# Altium project MC-IMX6Q-BOARD.PRJPCB
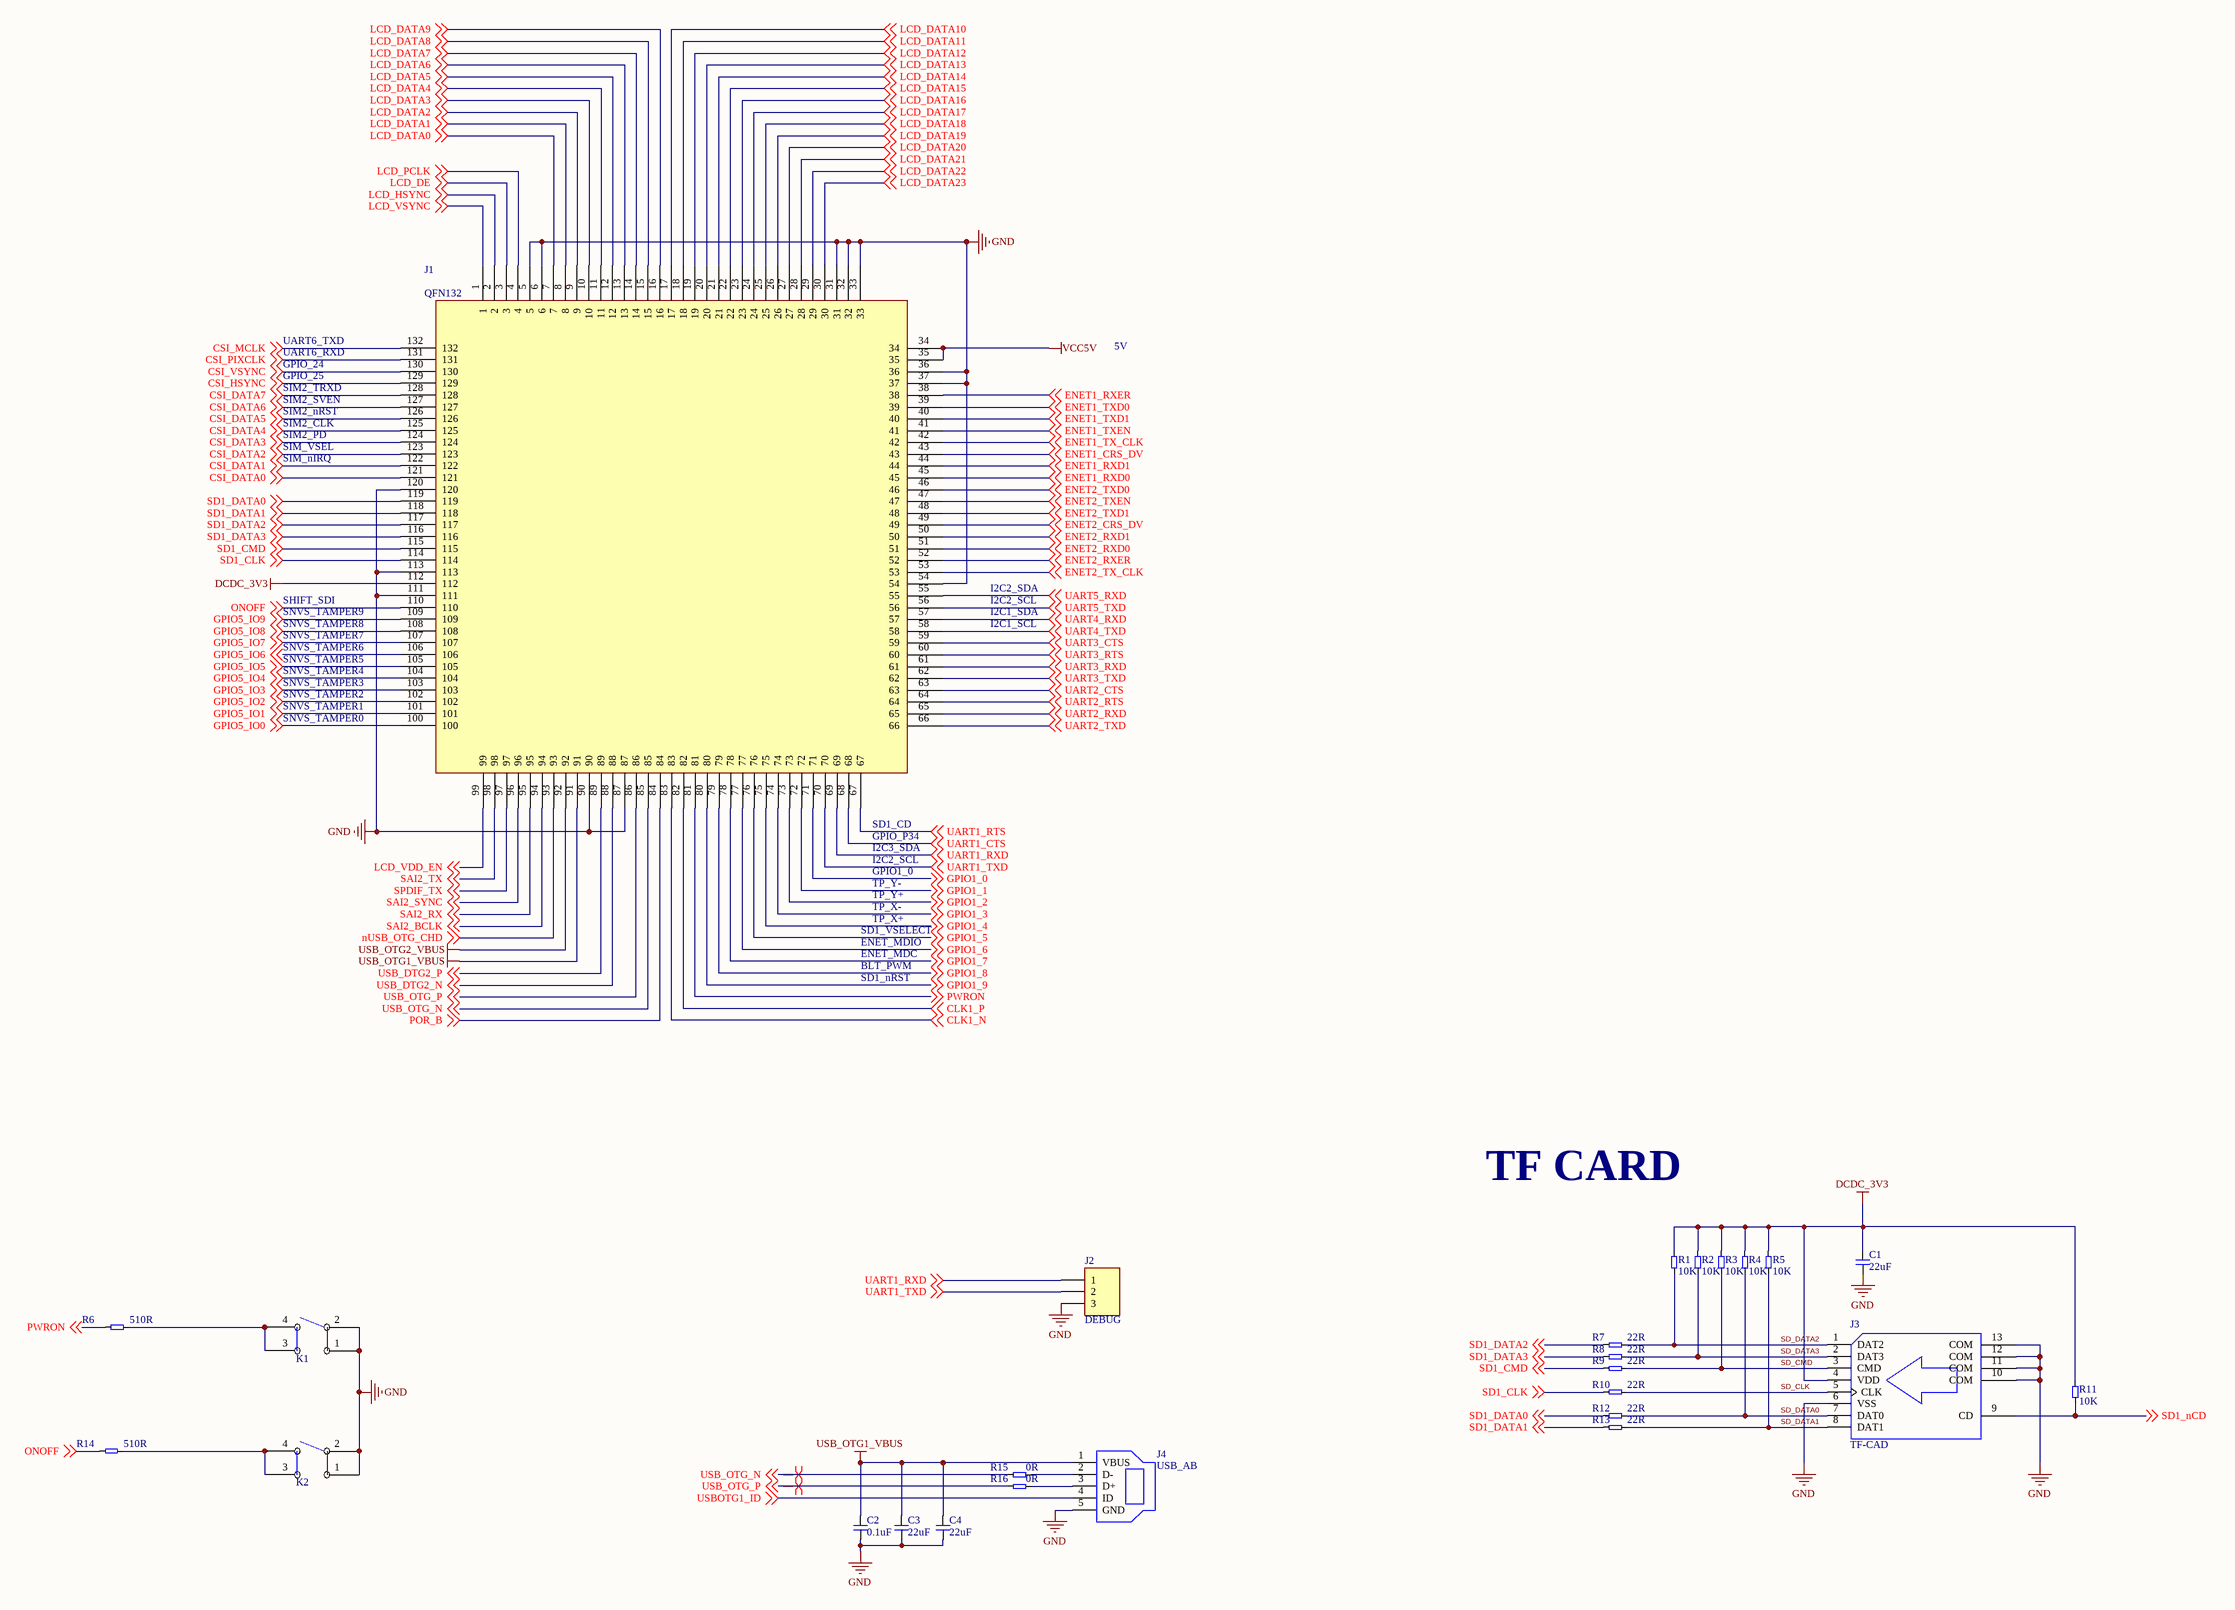
[diagram p0: 0.CONNECTOR.SchDoc]
4 sheets, 146 parts. Net scope: global (net labels, ports and power ports of the same name join across sheets).
Board file: IMX6.PcbDoc
Sheets:
  0.CONNECTOR.SchDoc
  1.POWER.SchDoc
  2.ETH.SchDoc
  9.RGB&TOUCH.SchDoc

## Sheet 0.CONNECTOR.SchDoc
size A2

### Parts
C1  22uF  [0805C]
C2  0.1uF  [0603C]
C3  22uF  [0805C]
C4  22uF  [0805C]
J1  QFN132  [QFN132]
J2  DEBUG  [HDR1X3]
J3  TF-CAD  [TF-CARD]
J4  USB_AB  [MINI USB B]
K1  按键  [SS-SPB-4.5]  (value not drawn)
K2  按键  [SS-SPB-4.5]  (value not drawn)
R1  10K  [0603R]
R2  10K  [0603R]
R3  10K  [0603R]
R4  10K  [0603R]
R5  10K  [0603R]
R6  510R  [0603R]
R7  22R  [0603R]
R8  22R  [0603R]
R9  22R  [0603R]
R10  22R  [0603R]
R11  10K  [0603R]
R12  22R  [0603R]
R13  22R  [0603R]
R14  510R  [0603R]
R15  0R  [0603R]
R16  0R  [0603R]

### Nets
DCDC_3V3: C1.2 J1.112 J3.4(VDD) R1.2 R2.2 R3.2 R4.2 R5.2 R11.2
EARTH: C1.1 C2.1 C3.1 C4.1 J1.5 J1.6 J1.31 J1.32 J1.33 J1.36 J1.37 J1.54 J1.87 J1.90 J1.111 J1.113 J1.120 J2.3 J3.6(VSS) J3.10(COM) J3.11(COM) J3.12(COM) J3.13(COM) J4.5(GND) J4.6(9) J4.7(9) J4.8(9) J4.9 K1.1 K1.2 K2.1 K2.2  [also labelled GND]  [project net AUGND]
USB_OTG1_VBUS: C2.2 C3.2 C4.2 J1.91 J4.1(VBUS)
USB_OTG2_VBUS: J1.92
VCC5V: J1.34 J1.35
CLK1_N: J1.83 ; off-sheet CLK1_N
CLK1_P: J1.82 ; off-sheet CLK1_P
CSI_DATA0: J1.121 ; off-sheet CSI_DATA0
CSI_DATA1: J1.122 ; off-sheet CSI_DATA1
CSI_DATA2: J1.123 ; off-sheet CSI_DATA2
CSI_DATA3: J1.124 ; off-sheet CSI_DATA3
CSI_DATA4: J1.125 ; off-sheet CSI_DATA4
CSI_DATA5: J1.126 ; off-sheet CSI_DATA5
CSI_DATA6: J1.127 ; off-sheet CSI_DATA6
CSI_DATA7: J1.128 ; off-sheet CSI_DATA7
CSI_HSYNC: J1.129 ; off-sheet CSI_HSYNC
CSI_MCLK: J1.132 ; off-sheet CSI_MCLK
CSI_PIXCLK: J1.131 ; off-sheet CSI_PIXCLK
CSI_VSYNC: J1.130 ; off-sheet CSI_VSYNC
ENET1_CRS_DV: J1.43 ; off-sheet ENET1_CRS_DV
ENET1_RXD0: J1.45 ; off-sheet ENET1_RXD0
ENET1_RXD1: J1.44 ; off-sheet ENET1_RXD1
ENET1_RXER: J1.38 ; off-sheet ENET1_RXER
ENET1_TX_CLK: J1.42 ; off-sheet ENET1_TX_CLK
ENET1_TXD0: J1.39 ; off-sheet ENET1_TXD0
ENET1_TXD1: J1.40 ; off-sheet ENET1_TXD1
ENET1_TXEN: J1.41 ; off-sheet ENET1_TXEN
ENET2_CRS_DV: J1.49 ; off-sheet ENET2_CRS_DV
ENET2_RXD0: J1.51 ; off-sheet ENET2_RXD0
ENET2_RXD1: J1.50 ; off-sheet ENET2_RXD1
ENET2_RXER: J1.52 ; off-sheet ENET2_RXER
ENET2_TX_CLK: J1.53 ; off-sheet ENET2_TX_CLK
ENET2_TXD0: J1.46 ; off-sheet ENET2_TXD0
ENET2_TXD1: J1.48 ; off-sheet ENET2_TXD1
ENET2_TXEN: J1.47 ; off-sheet ENET2_TXEN
GPIO1_0: J1.71 ; off-sheet GPIO1_0
GPIO1_1: J1.72 ; off-sheet GPIO1_1
GPIO1_2: J1.73 ; off-sheet GPIO1_2
GPIO1_3: J1.74 ; off-sheet GPIO1_3
GPIO1_4: J1.75 ; off-sheet GPIO1_4
GPIO1_5: J1.76 ; off-sheet GPIO1_5
GPIO1_6: J1.77 ; off-sheet GPIO1_6
GPIO1_7: J1.78 ; off-sheet GPIO1_7
GPIO1_8: J1.79 ; off-sheet GPIO1_8
GPIO1_9: J1.80 ; off-sheet GPIO1_9
GPIO5_IO0: J1.100 ; off-sheet GPIO5_IO0
GPIO5_IO1: J1.101 ; off-sheet GPIO5_IO1
GPIO5_IO2: J1.102 ; off-sheet GPIO5_IO2
GPIO5_IO3: J1.103 ; off-sheet GPIO5_IO3
GPIO5_IO4: J1.104 ; off-sheet GPIO5_IO4
GPIO5_IO5: J1.105 ; off-sheet GPIO5_IO5
GPIO5_IO6: J1.106 ; off-sheet GPIO5_IO6
GPIO5_IO7: J1.107 ; off-sheet GPIO5_IO7
GPIO5_IO8: J1.108 ; off-sheet GPIO5_IO8
GPIO5_IO9: J1.109 ; off-sheet GPIO5_IO9
LCD_DATA0: J1.7 ; off-sheet LCD_DATA0
LCD_DATA1: J1.8 ; off-sheet LCD_DATA1
LCD_DATA2: J1.9 ; off-sheet LCD_DATA2
LCD_DATA3: J1.10 ; off-sheet LCD_DATA3
LCD_DATA4: J1.11 ; off-sheet LCD_DATA4
LCD_DATA5: J1.12 ; off-sheet LCD_DATA5
LCD_DATA6: J1.13 ; off-sheet LCD_DATA6
LCD_DATA7: J1.14 ; off-sheet LCD_DATA7
LCD_DATA8: J1.15 ; off-sheet LCD_DATA8
LCD_DATA9: J1.16 ; off-sheet LCD_DATA9
LCD_DATA10: J1.17 ; off-sheet LCD_DATA10
LCD_DATA11: J1.18 ; off-sheet LCD_DATA11
LCD_DATA12: J1.19 ; off-sheet LCD_DATA12
LCD_DATA13: J1.20 ; off-sheet LCD_DATA13
LCD_DATA14: J1.21 ; off-sheet LCD_DATA14
LCD_DATA15: J1.22 ; off-sheet LCD_DATA15
LCD_DATA16: J1.23 ; off-sheet LCD_DATA16
LCD_DATA17: J1.24 ; off-sheet LCD_DATA17
LCD_DATA18: J1.25 ; off-sheet LCD_DATA18
LCD_DATA19: J1.26 ; off-sheet LCD_DATA19
LCD_DATA20: J1.27 ; off-sheet LCD_DATA20
LCD_DATA21: J1.28 ; off-sheet LCD_DATA21
LCD_DATA22: J1.29 ; off-sheet LCD_DATA22
LCD_DATA23: J1.30 ; off-sheet LCD_DATA23
LCD_DE: J1.3 ; off-sheet LCD_DE
LCD_HSYNC: J1.2 ; off-sheet LCD_HSYNC
LCD_PCLK: J1.4 ; off-sheet LCD_PCLK
LCD_VDD_EN: J1.99 ; off-sheet LCD_VDD_EN
LCD_VSYNC: J1.1 ; off-sheet LCD_VSYNC
nUSB_OTG_CHD: J1.93 ; off-sheet nUSB_OTG_CHD
ONOFF: J1.110 R14.2 ; off-sheet ONOFF
POR_B: J1.84 ; off-sheet POR_B
PWRON: J1.81 R6.2 ; off-sheet PWRON
SAI2_BCLK: J1.94 ; off-sheet SAI2_BCLK
SAI2_RX: J1.95 ; off-sheet SAI2_RX
SAI2_SYNC: J1.96 ; off-sheet SAI2_SYNC
SAI2_TX: J1.98 ; off-sheet SAI2_TX
SD1_CLK: J1.114 R10.1 ; off-sheet SD1_CLK
SD1_CMD: J1.115 R9.1 ; off-sheet SD1_CMD
SD1_DATA0: J1.119 R12.1 ; off-sheet SD1_DATA0
SD1_DATA1: J1.118 R13.1 ; off-sheet SD1_DATA1
SD1_DATA2: J1.117 R7.1 ; off-sheet SD1_DATA2
SD1_DATA3: J1.116 R8.1 ; off-sheet SD1_DATA3
SD1_nCD: J3.9(CD) R11.1 ; off-sheet SD1_nCD
SD_CLK: J3.5(CLK) R10.2
SD_CMD: J3.3(CMD) R3.1 R9.2
SD_DATA0: J3.7(DAT0) R4.1 R12.2
SD_DATA1: J3.8(DAT1) R5.1 R13.2
SD_DATA2: J3.1(DAT2) R1.1 R7.2
SD_DATA3: J3.2(DAT3) R2.1 R8.2
SPDIF_TX: J1.97 ; off-sheet SPDIF_TX
UART1_CTS: J1.68 ; off-sheet UART1_CTS
UART1_RTS: J1.67 ; off-sheet UART1_RTS
UART1_RXD: J1.69 J2.1 ; off-sheet UART1_RXD
UART1_TXD: J1.70 J2.2 ; off-sheet UART1_TXD
UART2_CTS: J1.63 ; off-sheet UART2_CTS
UART2_RTS: J1.64 ; off-sheet UART2_RTS
UART2_RXD: J1.65 ; off-sheet UART2_RXD
UART2_TXD: J1.66 ; off-sheet UART2_TXD
UART3_CTS: J1.59 ; off-sheet UART3_CTS
UART3_RTS: J1.60 ; off-sheet UART3_RTS
UART3_RXD: J1.61 ; off-sheet UART3_RXD
UART3_TXD: J1.62 ; off-sheet UART3_TXD
UART4_RXD: J1.57 ; off-sheet UART4_RXD
UART4_TXD: J1.58 ; off-sheet UART4_TXD
UART5_RXD: J1.55 ; off-sheet UART5_RXD
UART5_TXD: J1.56 ; off-sheet UART5_TXD
USB_DTG2_N: J1.88 ; off-sheet USB_DTG2_N
USB_DTG2_P: J1.89 ; off-sheet USB_DTG2_P
USB_OTG_N: J1.85 R15.2 ; off-sheet USB_OTG_N
USB_OTG_P: J1.86 R16.2 ; off-sheet USB_OTG_P
USBOTG1_ID: J4.4(ID) ; off-sheet USBOTG1_ID
NetJ4_2: J4.2(D-) R15.1
NetJ4_3: J4.3(D+) R16.1
NetK1_3: K1.3 K1.4 R6.1
NetK2_3: K2.3 K2.4 R14.1

### Layout directives
differential pair: USB_OTG_N, USB_OTG_P

### Notes on the sheet
- UART6_TXD
- UART6_RXD
- GPIO_24
- GPIO_25
- SIM2_TRXD
- 5V
- SIM2_PD
- SIM2_CLK
- SIM2_nRST
- SIM2_SVEN
- SIM_nIRQ
- SIM_VSEL
- SNVS_TAMPER8
- SNVS_TAMPER9
- SHIFT_SDI
- I2C1_SCL
- I2C1_SDA
- I2C2_SCL
- I2C2_SDA
- SNVS_TAMPER4
- SNVS_TAMPER5
- SNVS_TAMPER7
- SNVS_TAMPER6
- SNVS_TAMPER0
- SNVS_TAMPER1
- SNVS_TAMPER2
- SNVS_TAMPER3
- I2C3_SDA
- SD1_CD
- GPIO_P34
- GPIO1_0
- TP_Y-
- TP_Y+
- TP_X-
- SD1_VSELECT
- ENET_MDIO
- ENET_MDC
- BLT_PWM
- SD1_nRST
- TP_X+
- TF CARD

### Library data of the parts
C1-C4 = 电容
J2 = Header 3: Header, 3-Pin; LatestRevisionDate: 17-Jul-2002; LatestRevisionNote: Re-released for DXP Platform.; Publisher: Altium Limited
J4 = USB_AB: 小USB插痤
R1-R16 = 电阻

## Sheet 1.POWER.SchDoc
size A4
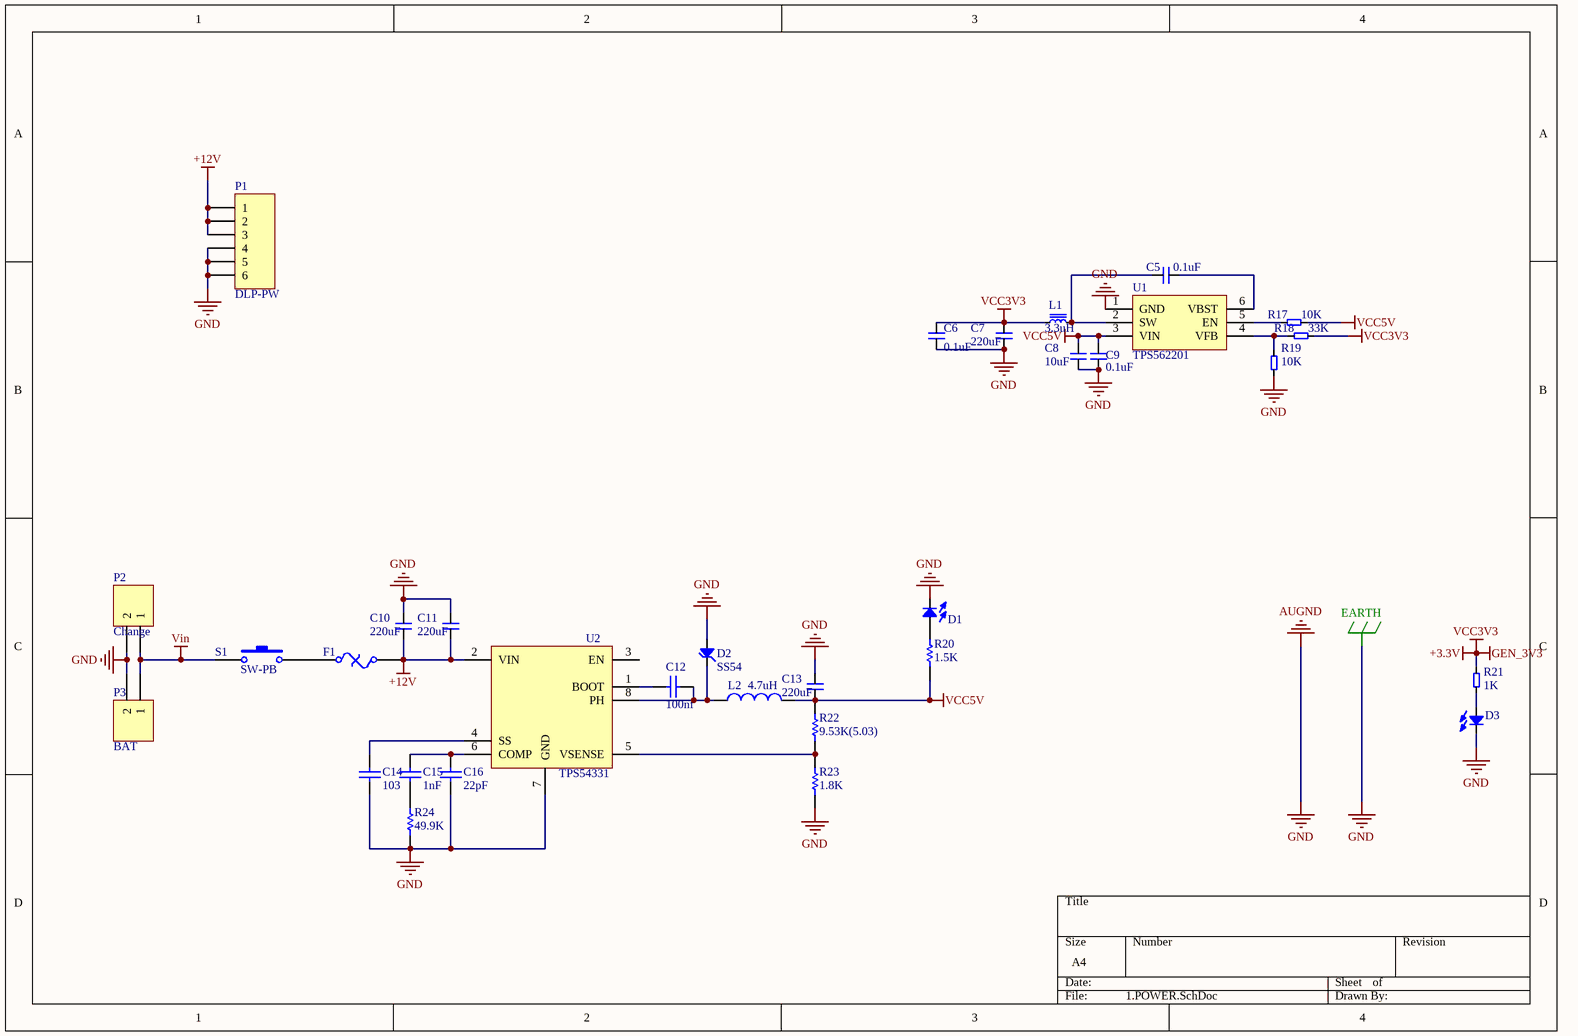
[diagram p1: 1.POWER.SchDoc]

### Parts
C5  0.1uF  [0603C]
C6  0.1uF  [0603C]
C7  220uF  [1210C]
C8  10uF  [0603C]
C9  0.1uF  [0603C]
C10  220uF  [1210C]
C11  220uF  [1210C]
C12  value 100nf  [0603C]  (hidden comment: Cap)
C13  220uF  [1210C]
C14  value 103  [0603C]  (hidden comment: Cap)
C15  value 1nF  [0603C]  (hidden comment: Cap)
C16  value 22pF  [0603C]  (hidden comment: Cap)
D1  发光二极管  [0603D]  (value not drawn)
D2  SS54  [SMA]
D3  发光二极管  [0603D]  (value not drawn)
F1  Fuse Thermal  [1812F]  (value not drawn)
L1  3.3uH  [L4030]
L2  value 4.7uH  [L-6045]  (hidden comment: Inductor)
P1  DLP-PW  [SH1.0-6P]
P2  Change  [DC-005]
P3  BAT  [XH2.54-2P]
R17  10K  [0603R]
R18  33K  [0603R]
R19  10K  [0603R]
R20  value 1.5K  [0603R]  (hidden comment: Res1)
R21  1K  [0603R]
R22  value 9.53K(5.03)  [0603R]  (hidden comment: Res Semi)
R23  value 1.8K  [0603R]  (hidden comment: Res Semi)
R24  value 49.9K  [0603R]  (hidden comment: Res Semi)
S1  SW-PB  [SPST-2]
U1  TPS562201  [SOT23-6-DC]
U2  TPS54331  [SOP8-POW]

### Nets
+3.3V: C6.1 C7.1 L1.1 R18.1 R21.2  [also labelled GEN_3V3, VCC3V3]
+12V: C10.2 C11.2 F1.2 P1.1 P1.2 P1.3 U2.2(VIN)
AUGND: C6.2 C7.2 C8.2 C9.2 C10.1 C11.1 C13.1 C14.2 C16.1 D1.K D2.A D3.K P1.4 P1.5 P1.6 P2.2 P3.2 R19.1 R23.1 R24.1 U1.1(GND) U2.7(GND) U2.9(PAD)  [also labelled EARTH, GND]
VCC5V: C8.1 C9.1 C13.2 L2.2 R17.1 R20.1 R22.2 U1.3(VIN)
Vin: P2.1 P3.1 S1.1
NetC5_1: C5.1 L1.2 U1.2(SW)
NetC5_2: C5.2 U1.6(VBST)
NetC12_1: C12.1 D2.K L2.1 U2.8(PH)
NetC12_2: C12.2 U2.1(BOOT)
NetC14_1: C14.1 U2.4(SS)
NetC15_1: C15.1 R24.2
NetC15_2: C15.2 C16.2 U2.6(COMP)
NetD1_A: D1.A R20.2
NetD3_A: D3.A R21.1
NetF1_1: F1.1 S1.2
NetR17_2: R17.2 U1.5(EN)
NetR18_2: R18.2 R19.2 U1.4(VFB)
NetR22_1: R22.1 R23.2 U2.5(VSENSE)

Not connected (* = marked no-connect by the designer): U2 3(EN)

### Library data of the parts
C5-C11 C13 = 电容
C12 C14-C16 = Cap: Capacitor; Published: 8-Jun-2000; LatestRevisionDate: 17-Jul-2002; LatestRevisionNote: Re-released for DXP Platform.; PackageReference: RAD-0.3; Publisher: Altium Limited
  C14-C16: PackageDescription: Radial Cap, Thru-Hole; 2 Leads; 0.3 in Pin Spacing
D2 = SS24: DIODES: *
F1 = Fuse Thermal: Thermal Fuse; Published: 24-Mar-1999; LatestRevisionDate: 17-Jul-2002; LatestRevisionNote: Re-released for DXP Platform.; PackageReference: PIN-W2/E2.8; Publisher: Altium Limited
L1 = 功率电感
L2 = Inductor: Code_IEC: 1005; Published: 8-Jun-2000; LatestRevisionDate: 17-Jul-2002; LatestRevisionNote: Re-released for DXP Platform.; PackageReference: 0402-A; Publisher: Altium Limited; Code_JEITA: 0402
P1 = Header 6: Header, 6-Pin; LatestRevisionDate: 17-Jul-2002; LatestRevisionNote: Re-released for DXP Platform.; Publisher: Altium Limited
P2 P3 = Header 2: Header, 2-Pin; LatestRevisionDate: 17-Jul-2002; LatestRevisionNote: Re-released for DXP Platform.; Publisher: Altium Limited
R17-R19 R21 = 电阻
R20 = Res1: Resistor; Published: 8-Jun-2000; LatestRevisionDate: 17-Jul-2002; LatestRevisionNote: Re-released for DXP Platform.; PackageReference: AXIAL-0.3; Publisher: Altium Limited
R22-R24 = Res Semi: Semiconductor Resistor; Published: 8-Jun-2000; LatestRevisionDate: 17-Jul-2002; LatestRevisionNote: Re-released for DXP Platform.; PackageReference: AXIAL-0.5; Publisher: Altium Limited; PackageDescription: Axial Device, Thru-Hole; 2 Leads; 0.5 in Pin Spacing
S1 = SW-PB: Switch; Published: 24-Mar-1999; LatestRevisionDate: 17-Jul-2002; LatestRevisionNote: Re-released for DXP Platform.; PackageReference: SPST-2; Publisher: Altium Limited

## Sheet 2.ETH.SchDoc
size A3
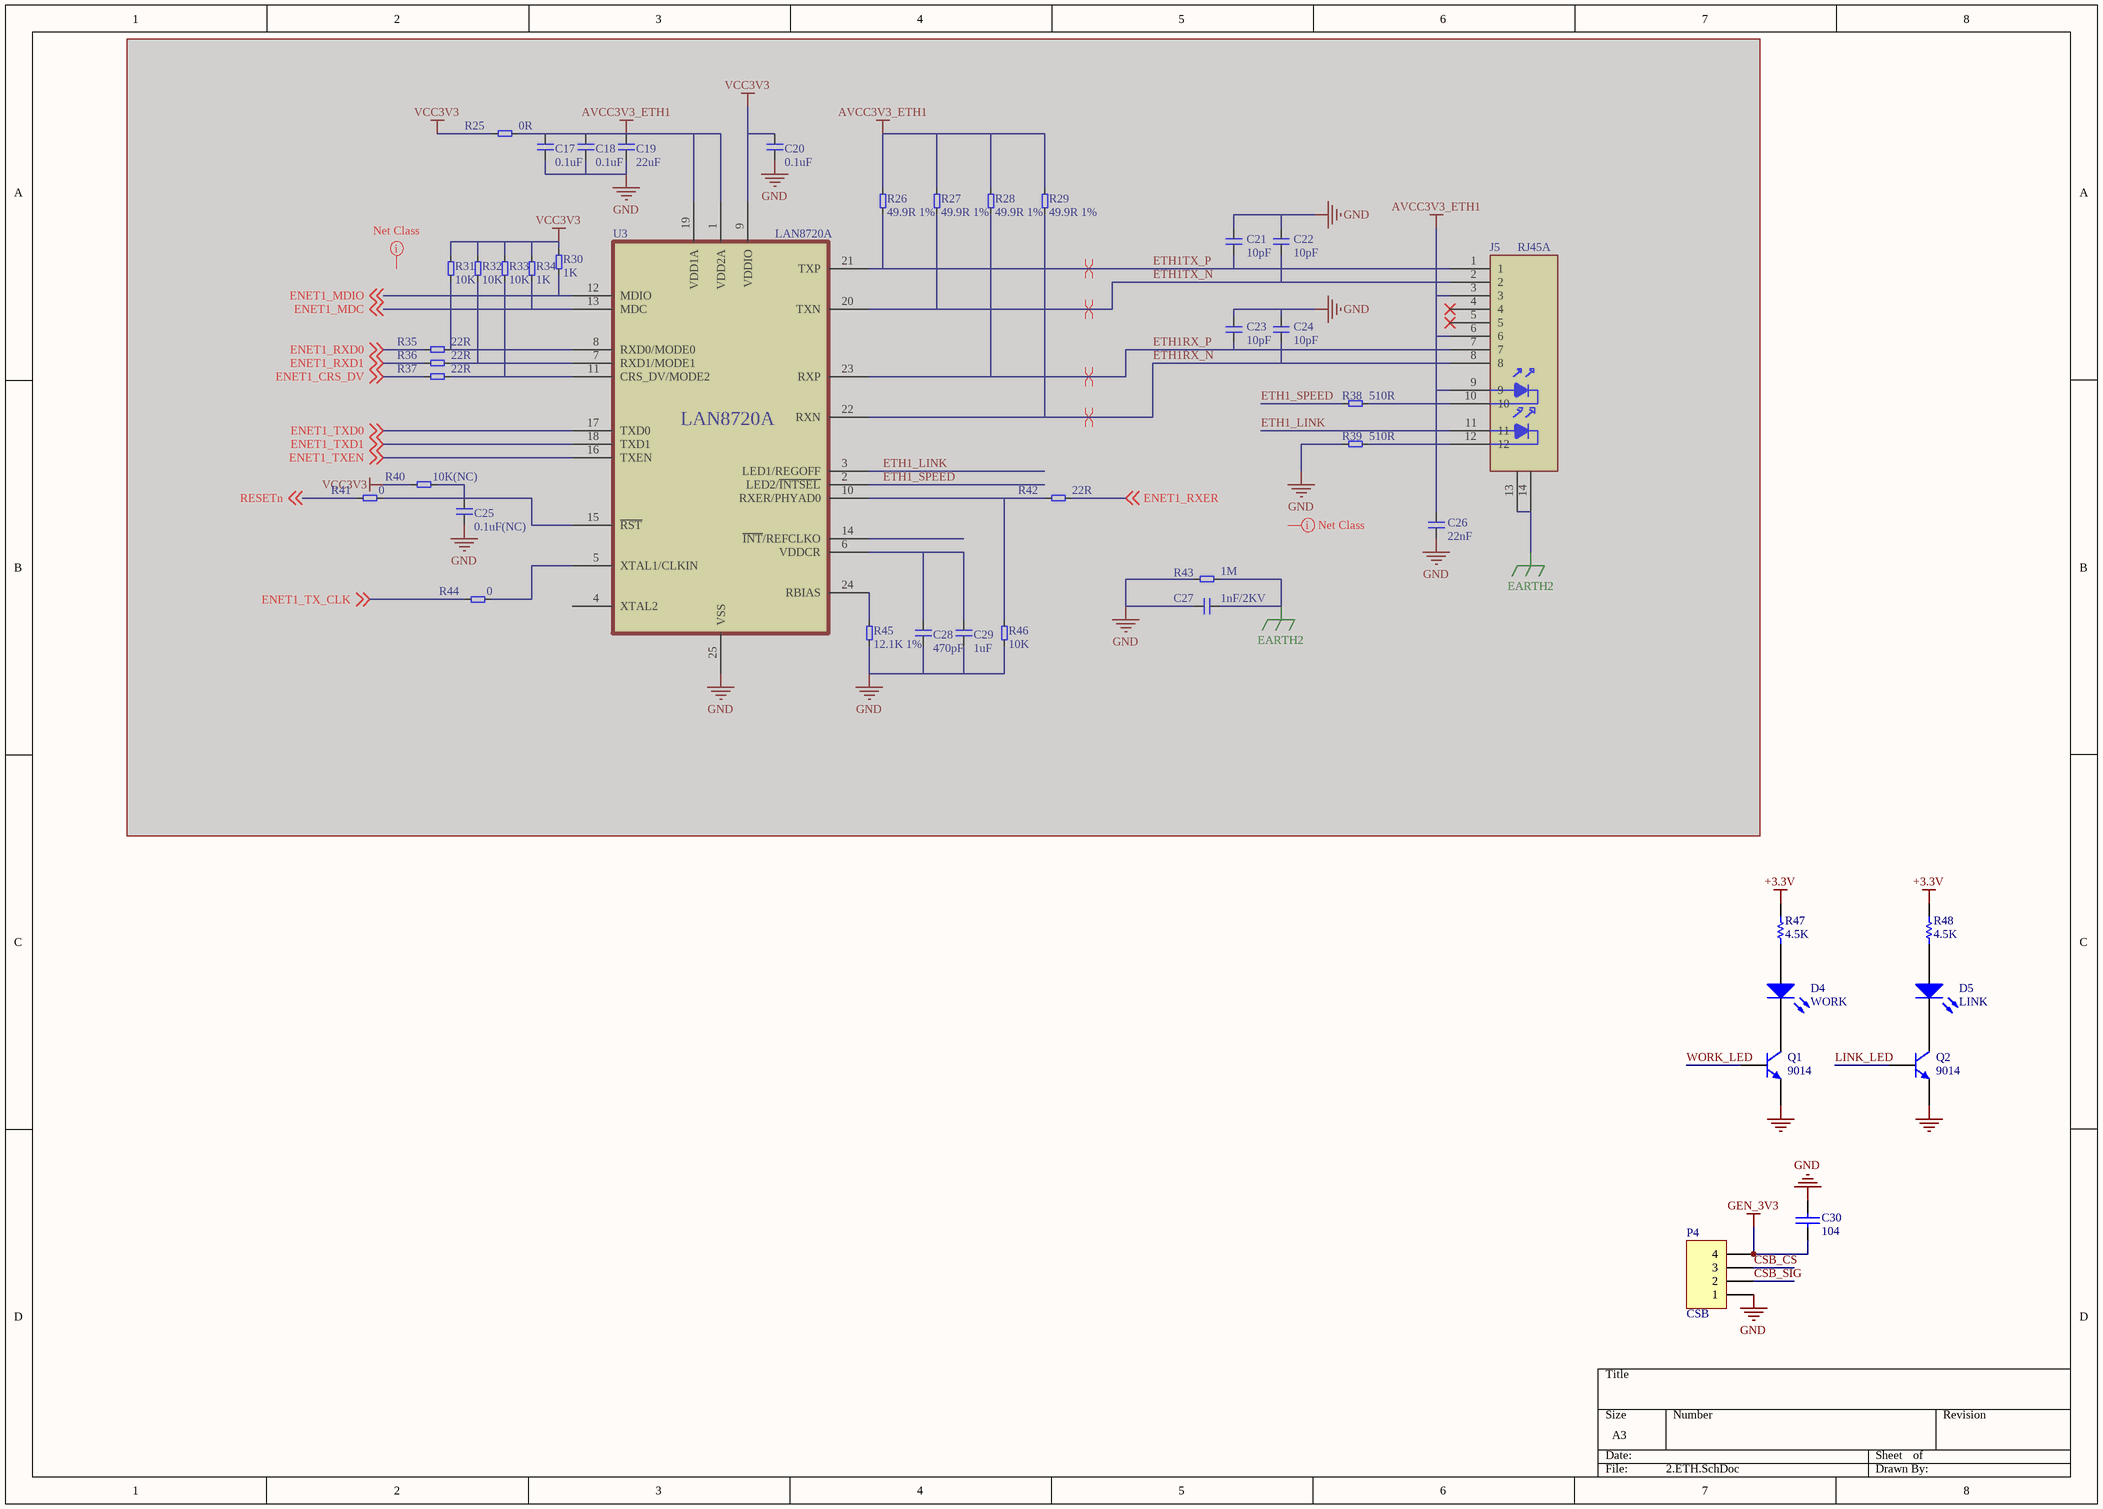
[diagram p2: 2.ETH.SchDoc]

### Parts
(Parts that share a designator on the sheet are numbered #1, #2 ... from top to bottom, then left to right.)
C17#1  0.1uF  [0603C]  (masked out: inside a compile mask, not in the netlist)
C18#1  0.1uF  [0603C]  (masked out: inside a compile mask, not in the netlist)
C19  22uF  [0805C]  (masked out: inside a compile mask, not in the netlist)
C20  0.1uF  [0603C]  (masked out: inside a compile mask, not in the netlist)
C21  10pF  [0603C]  (masked out: inside a compile mask, not in the netlist)
C22  10pF  [0603C]  (masked out: inside a compile mask, not in the netlist)
C23  10pF  [0603C]  (masked out: inside a compile mask, not in the netlist)
C24  10pF  [0603C]  (masked out: inside a compile mask, not in the netlist)
C25  0.1uF(NC)  [0603C]  (masked out: inside a compile mask, not in the netlist)
C26  22nF  [0603C]  (masked out: inside a compile mask, not in the netlist)
C27  1nF/2KV  [DC-200]  (masked out: inside a compile mask, not in the netlist)
C28  470pF  [0603C]  (masked out: inside a compile mask, not in the netlist)
C29  1uF  [0603C]  (masked out: inside a compile mask, not in the netlist)
C30  104  [0603]
D4  WORK  [0603-LED]
D5  LINK  [0603-LED]
J5#1  RJ45A  [RJ45B-13F-60LDNL]  (masked out: inside a compile mask, not in the netlist)
P4  CSB  [HDR1X4]
Q1  value 9014  [SOT-23-NPN]  (hidden comment: NPN)
Q2  value 9014  [SOT-23-NPN]  (hidden comment: NPN)
R25  0R  [0603R]  (masked out: inside a compile mask, not in the netlist)
R26  49.9R 1%  [0603R]  (masked out: inside a compile mask, not in the netlist)
R27  49.9R 1%  [0603R]  (masked out: inside a compile mask, not in the netlist)
R28  49.9R 1%  [0603R]  (masked out: inside a compile mask, not in the netlist)
R29  49.9R 1%  [0603R]  (masked out: inside a compile mask, not in the netlist)
R30  1K  [0603R]  (masked out: inside a compile mask, not in the netlist)
R31  10K  [0603R]  (masked out: inside a compile mask, not in the netlist)
R32  10K  [0603R]  (masked out: inside a compile mask, not in the netlist)
R33  10K  [0603R]  (masked out: inside a compile mask, not in the netlist)
R34  1K  [0603R]  (masked out: inside a compile mask, not in the netlist)
R35  22R  [0603R]  (masked out: inside a compile mask, not in the netlist)
R36  22R  [0603R]  (masked out: inside a compile mask, not in the netlist)
R37  22R  [0603R]  (masked out: inside a compile mask, not in the netlist)
R38  510R  [0603R]  (masked out: inside a compile mask, not in the netlist)
R39  510R  [0603R]  (masked out: inside a compile mask, not in the netlist)
R40  10K(NC)  [0603R]  (masked out: inside a compile mask, not in the netlist)
R41  0  [0603R]  (masked out: inside a compile mask, not in the netlist)
R42  22R  [0603R]  (masked out: inside a compile mask, not in the netlist)
R43  1M  [1206R]  (masked out: inside a compile mask, not in the netlist)
R44  0  [0603R]  (masked out: inside a compile mask, not in the netlist)
R45  12.1K 1%  [0603R]  (masked out: inside a compile mask, not in the netlist)
R46  10K  [0603R]  (masked out: inside a compile mask, not in the netlist)
R47  value 4.5K  [0603]  (hidden comment: Res1)
R48  value 4.5K  [0603]  (hidden comment: Res1)
U3  LAN8720A  [QFN24]  (masked out: inside a compile mask, not in the netlist)

### Nets
+3.3V: C30.2 P4.4 R47.1 R48.1  [also labelled GEN_3V3]
GND: C30.1 P4.1 Q1.1(E) Q2.1(E)  [project net AUGND]
CSB_CS: P4.3
CSB_SIG: P4.2
LINK_LED: Q2.2(B)
WORK_LED: Q1.2(B)
NetD4_1: D4.1(A) R47.2
NetD4_2: D4.2(K) Q1.3(C)
NetD5_1: D5.1(A) R48.2
NetD5_2: D5.2(K) Q2.3(C)

### Layout directives
differential pair: (no net found under the mark)
net class ETH0: (no net found under the mark)

### Library data of the parts
C17#1 C18#1 C19-C29 = 电容
C30 = CAP
D4 D5 = LED2: Typical RED, GREEN, YELLOW, AMBER GaAs LED; Value: GRN; Published: 8-Jun-2000; LatestRevisionDate: 17-Jul-2002; LatestRevisionNote: Re-released for DXP Platform.; PackageDocument: Feb-2002; PackageReference: 3.2X1.6X1.1; Publisher: Altium Limited
P4 = Header 4: Header, 4-Pin; LatestRevisionDate: 17-Jul-2002; LatestRevisionNote: Re-released for DXP Platform.; Publisher: Altium Limited
Q1 Q2 = 2N5551: NPN General Purpose Amplifier; Published: 8-Jun-2000; LatestRevisionDate: 17-Jan-2003; LatestRevisionNote: PCB Footprint 'BCY-W3/D4.7' replaced; DatasheetDocument: 1997; PackageDocument: Sep-1998; PackageReference: TO-92A; Publisher: Altium Limited; ComponentLink1Description: Manufacturer Link; ComponentLink1URL: http://www.fairchildsemi.com/; ComponentLink2Description: Datasheet; ComponentLink2URL: http://www.fairchildsemi.com/ds/2N%2F2N5551.pdf
R25-R46 = 电阻
R47 R48 = Res1: Resistor; Published: 8-Jun-2000; LatestRevisionDate: 17-Jul-2002; LatestRevisionNote: Re-released for DXP Platform.; PackageReference: AXIAL-0.3; Publisher: Altium Limited

## Sheet 9.RGB&TOUCH.SchDoc
size A3
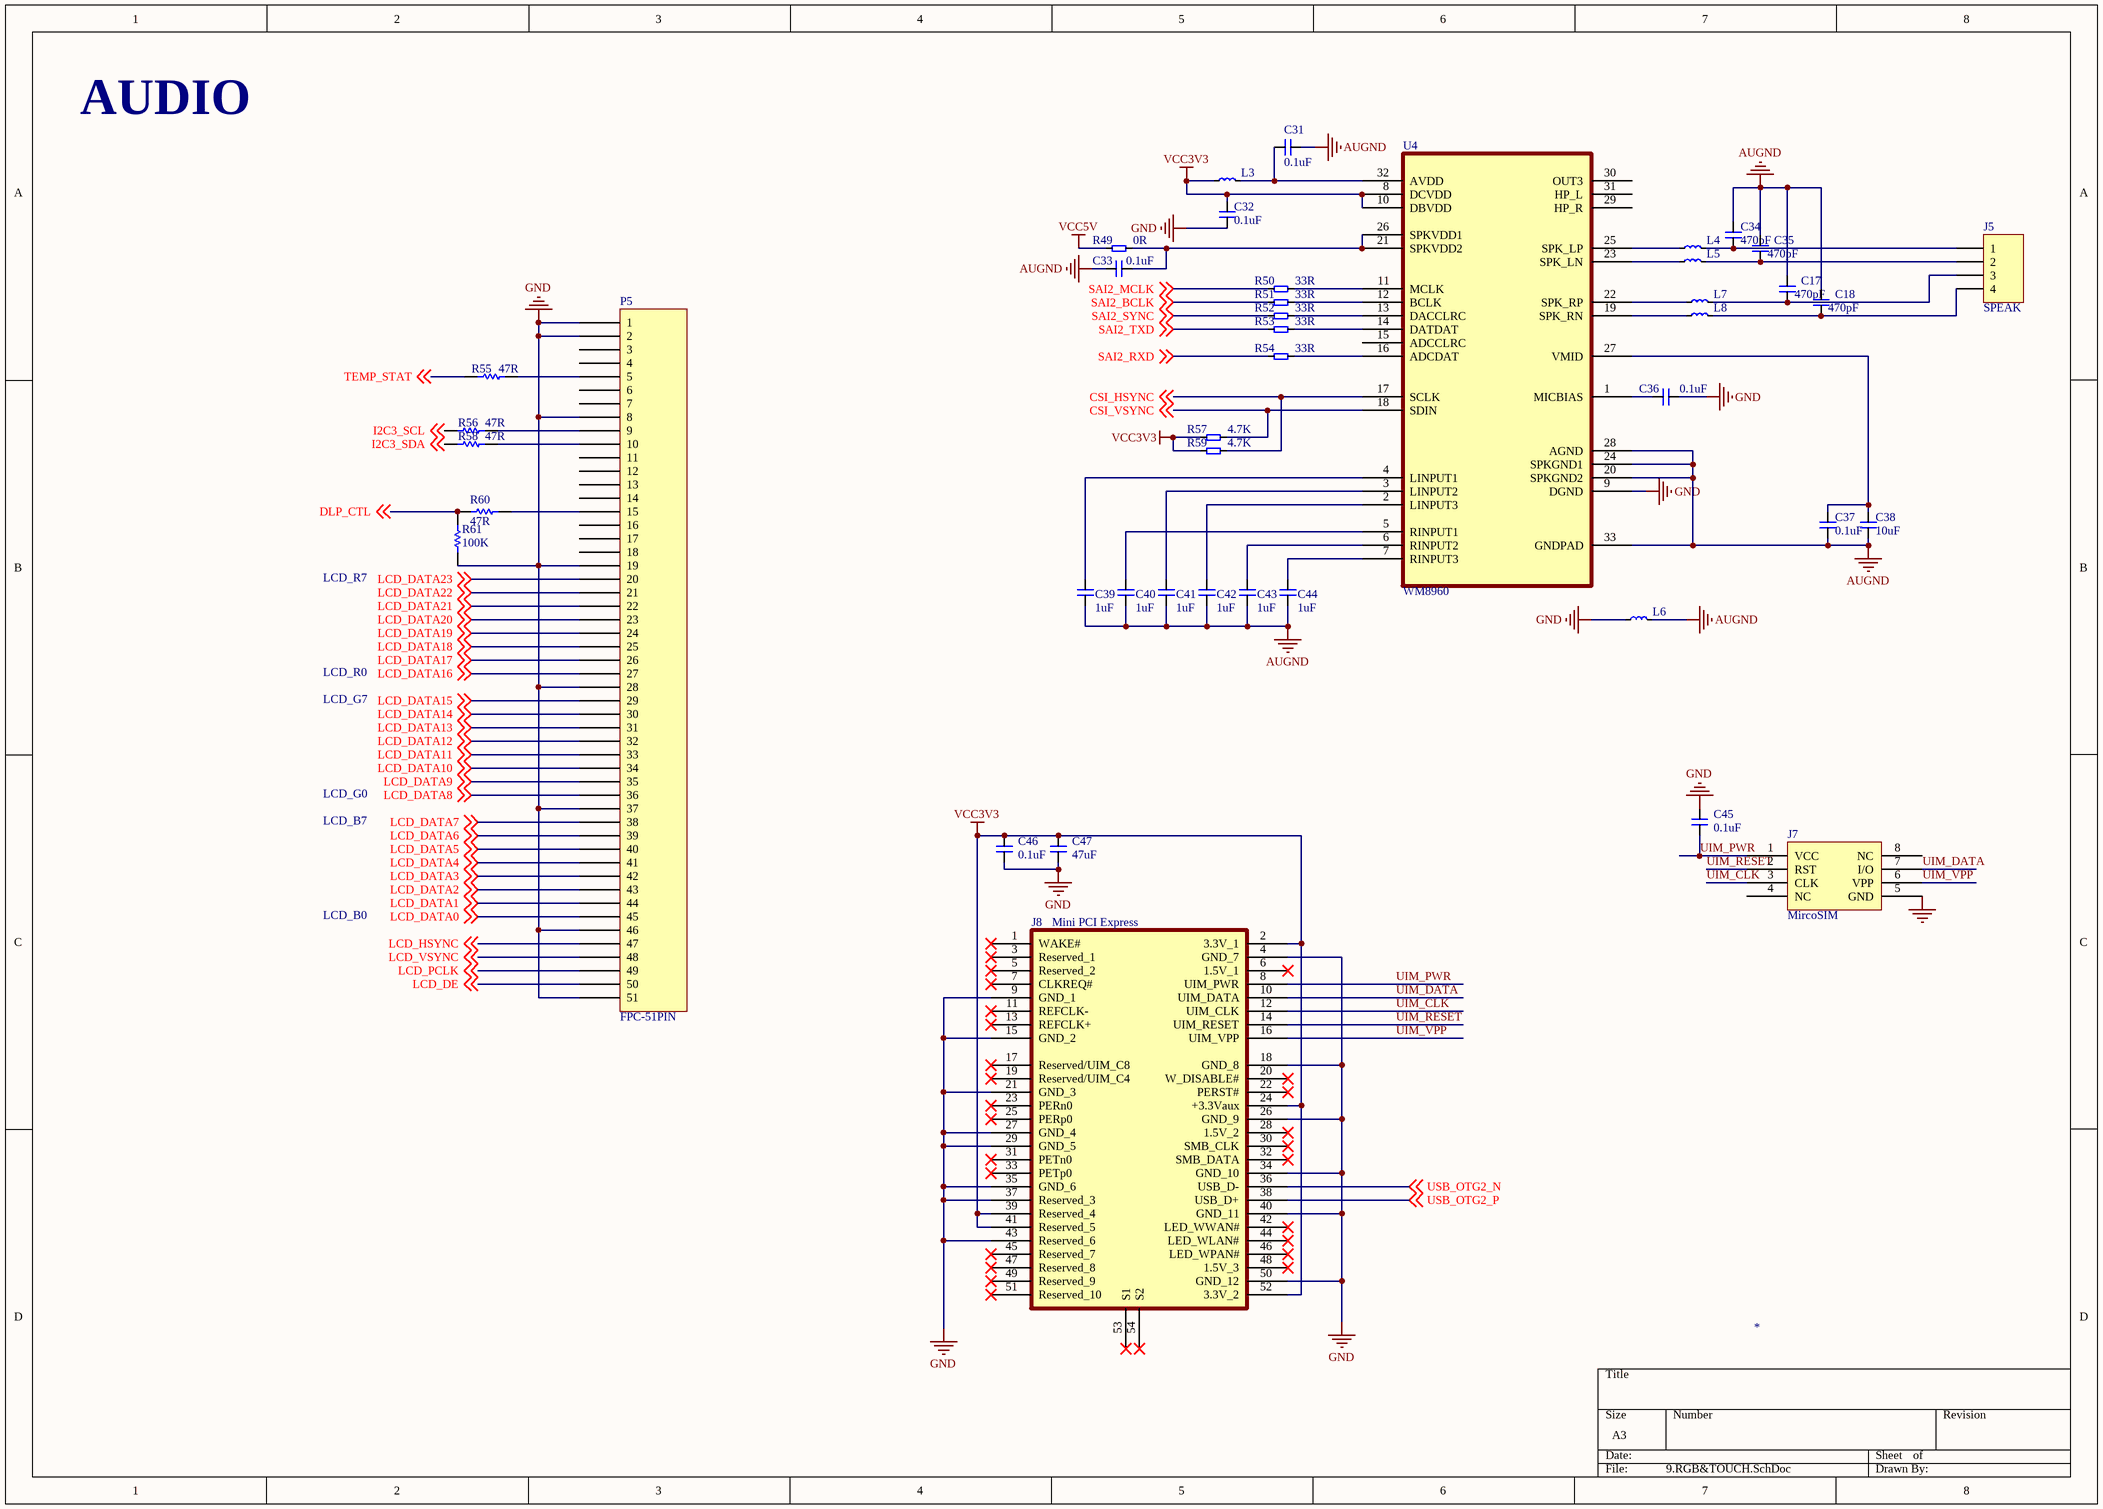
[diagram p3: 9.RGB&TOUCH.SchDoc]

### Parts
(Parts that share a designator on the sheet are numbered #1, #2 ... from top to bottom, then left to right.)
C17#2  470pF  [0603C]
C18#2  470pF  [0603C]
C31  0.1uF  [0603C]
C32  0.1uF  [0603C]
C33  0.1uF  [0603C]
C34  470pF  [0603C]
C35  470pF  [0603C]
C36  0.1uF  [0603C]
C37  0.1uF  [0603C]
C38  10uF  [0805C]
C39  1uF  [0603C]
C40  1uF  [0603C]
C41  1uF  [0603C]
C42  1uF  [0603C]
C43  1uF  [0603C]
C44  1uF  [0603C]
C45  0.1uF  [0603C]
C46  0.1uF  [0603C]
C47  47uF  [1206C]
J5#2  SPEAK  [1.25-4P]
J7  MircoSIM  [Micro SIM]
J8  Mini PCI Express  [MINI-PCIE-SHORT]
L3  电感  [0603L]  (value not drawn)
L4  电感  [0603L]  (value not drawn)
L5  电感  [0603L]  (value not drawn)
L6  电感  [0603L]  (value not drawn)
L7  电感  [0603L]  (value not drawn)
L8  电感  [0603L]  (value not drawn)
P5  FPC-51PIN  [FH26-51S-0.3SHW]
R49  0R  [0603R]
R50  33R  [0603R]
R51  33R  [0603R]
R52  33R  [0603R]
R53  33R  [0603R]
R54  33R  [0603R]
R55  47R  [0603]
R56  47R  [0603]
R57  4.7K  [0603R]
R58  47R  [0603]
R59  4.7K  [0603R]
R60  47R  [0603]
R61  100K  [0603]
U4  WM8960  [QFN-32]

### Nets
AUGND: C17#2.2 C18#2.2 C31.2 C32.2 C33.1 C34.2 C35.2 C36.2 C37.2 C38.2 C39.1 C40.1 C41.1 C42.1 C43.1 C44.1 C45.1 C46.2 C47.2 J7.5(GND) J8.4(GND_7) J8.9(GND_1) J8.15(GND_2) J8.18(GND_8) J8.21(GND_3) J8.26(GND_9) J8.27(GND_4) J8.29(GND_5) J8.34(GND_10) J8.35(GND_6) J8.37(Reserved_3) J8.40(GND_11) J8.43(Reserved_6) J8.50(GND_12) L6.1 L6.2 P5.1 P5.2 P5.8 P5.19 P5.28 P5.37 P5.46 P5.51 R61.1 U4.9(DGND) U4.20(SPKGND2) U4.24(SPKGND1) U4.28(AGND) U4.33(GNDPAD)  [also labelled GND]
VCC3V3: C32.1 C46.1 C47.1 J8.2(3.3V_1) J8.24(+3.3Vaux) J8.39(Reserved_4) J8.41(Reserved_5) J8.52(3.3V_2) L3.1 R57.1 R59.1 U4.8(DCVDD) U4.10(DBVDD)  [project net +3.3V]
VCC5V: R49.1
CSI_HSYNC: R59.2 U4.17(SCLK) ; off-sheet CSI_HSYNC
CSI_VSYNC: R57.2 U4.18(SDIN) ; off-sheet CSI_VSYNC
DLP_CTL: R60.1 R61.2 ; off-sheet DLP_CTL
I2C3_SCL: R56.1 ; off-sheet I2C3_SCL
I2C3_SDA: R58.1 ; off-sheet I2C3_SDA
LCD_DATA0: P5.45 ; off-sheet LCD_DATA0
LCD_DATA1: P5.44 ; off-sheet LCD_DATA1
LCD_DATA2: P5.43 ; off-sheet LCD_DATA2
LCD_DATA3: P5.42 ; off-sheet LCD_DATA3
LCD_DATA4: P5.41 ; off-sheet LCD_DATA4
LCD_DATA5: P5.40 ; off-sheet LCD_DATA5
LCD_DATA6: P5.39 ; off-sheet LCD_DATA6
LCD_DATA7: P5.38 ; off-sheet LCD_DATA7
LCD_DATA8: P5.36 ; off-sheet LCD_DATA8
LCD_DATA9: P5.35 ; off-sheet LCD_DATA9
LCD_DATA10: P5.34 ; off-sheet LCD_DATA10
LCD_DATA11: P5.33 ; off-sheet LCD_DATA11
LCD_DATA12: P5.32 ; off-sheet LCD_DATA12
LCD_DATA13: P5.31 ; off-sheet LCD_DATA13
LCD_DATA14: P5.30 ; off-sheet LCD_DATA14
LCD_DATA15: P5.29 ; off-sheet LCD_DATA15
LCD_DATA16: P5.27 ; off-sheet LCD_DATA16
LCD_DATA17: P5.26 ; off-sheet LCD_DATA17
LCD_DATA18: P5.25 ; off-sheet LCD_DATA18
LCD_DATA19: P5.24 ; off-sheet LCD_DATA19
LCD_DATA20: P5.23 ; off-sheet LCD_DATA20
LCD_DATA21: P5.22 ; off-sheet LCD_DATA21
LCD_DATA22: P5.21 ; off-sheet LCD_DATA22
LCD_DATA23: P5.20 ; off-sheet LCD_DATA23
LCD_DE: P5.50 ; off-sheet LCD_DE
LCD_HSYNC: P5.47 ; off-sheet LCD_HSYNC
LCD_PCLK: P5.49 ; off-sheet LCD_PCLK
LCD_VSYNC: P5.48 ; off-sheet LCD_VSYNC
SAI2_BCLK: R51.1 ; off-sheet SAI2_BCLK
SAI2_MCLK: R50.1 ; off-sheet SAI2_MCLK
SAI2_RXD: R54.1 ; off-sheet SAI2_RXD
SAI2_SYNC: R52.1 ; off-sheet SAI2_SYNC
SAI2_TXD: R53.1 ; off-sheet SAI2_TXD
TEMP_STAT: R55.1 ; off-sheet TEMP_STAT
UIM_CLK: J7.3(CLK) J8.12(UIM_CLK)
UIM_DATA: J7.7(I/O) J8.10(UIM_DATA)
UIM_PWR: C45.2 J7.1(VCC) J8.8(UIM_PWR)
UIM_RESET: J7.2(RST) J8.14(UIM_RESET)
UIM_VPP: J7.6(VPP) J8.16(UIM_VPP)
USB_OTG2_N: J8.36(USB_D-) ; off-sheet USB_OTG2_N
USB_OTG2_P: J8.38(USB_D+) ; off-sheet USB_OTG2_P
NetC17#2_1: C17#2.1 J5#2.3 L7.2
NetC18#2_1: C18#2.1 J5#2.4 L8.2
NetC31_1: C31.1 L3.2 U4.32(AVDD)
NetC33_2: C33.2 R49.2 U4.21(SPKVDD2) U4.26(SPKVDD1)
NetC34_1: C34.1 J5#2.1 L4.2
NetC35_1: C35.1 J5#2.2 L5.2
NetC36_1: C36.1 U4.1(MICBIAS)
NetC37_1: C37.1 C38.1 U4.27(VMID)
NetC39_2: C39.2 U4.4(LINPUT1)
NetC40_2: C40.2 U4.5(RINPUT1)
NetC41_2: C41.2 U4.3(LINPUT2)
NetC42_2: C42.2 U4.2(LINPUT3)
NetC43_2: C43.2 U4.6(RINPUT2)
NetC44_2: C44.2 U4.7(RINPUT3)
NetL4_1: L4.1 U4.25(SPK_LP)
NetL5_1: L5.1 U4.23(SPK_LN)
NetL7_1: L7.1 U4.22(SPK_RP)
NetL8_1: L8.1 U4.19(SPK_RN)
NetP5_5: P5.5 R55.2
NetP5_9: P5.9 R56.2
NetP5_10: P5.10 R58.2
NetP5_15: P5.15 R60.2
NetR50_2: R50.2 U4.11(MCLK)
NetR51_2: R51.2 U4.12(BCLK)
NetR52_2: R52.2 U4.13(DACCLRC)
NetR53_2: R53.2 U4.14(DATDAT)
NetR54_2: R54.2 U4.16(ADCDAT)

Not connected (* = marked no-connect by the designer): J7 4(NC) 8(NC); J8 1(WAKE#)* 3(Reserved_1)* 5(Reserved_2)* 6(1.5V_1)* 7(CLKREQ#)* 11(REFCLK-)* 13(REFCLK+)* 17(Reserved/UIM_C8)* 19(Reserved/UIM_C4)* 20(W_DISABLE#)* 22(PERST#)* 23(PERn0)* 25(PERp0)* 28(1.5V_2)* 30(SMB_CLK)* 31(PETn0)* 32(SMB_DATA)* 33(PETp0)* 42(LED_WWAN#)* 44(LED_WLAN#)* 45(Reserved_7)* 46(LED_WPAN#)* 47(Reserved_8)* 48(1.5V_3)* 49(Reserved_9)* 51(Reserved_10)* 53(S1)* 54(S2)*; P5 3 4 6 7 11 12 13 14 16 17 18; U4 15(ADCCLRC) 29(HP_R) 30(OUT3) 31(HP_L)

### Notes on the sheet
- AUDIO
- LCD_R7
- LCD_G7
- LCD_R0
- LCD_B7
- LCD_G0
- LCD_B0

### Library data of the parts
C17#2 C18#2 C31-C47 = 电容
J5#2 = Header 4: Header, 4-Pin; LatestRevisionDate: 17-Jul-2002; LatestRevisionNote: Re-released for DXP Platform.; Publisher: Altium Limited
J8 = MINIPCIE: MPC24-52K3311
R49-R54 R57 R59 = 电阻
R55 R56 R58 R60 R61 = Res1: Resistor

## Nets that join several sheets
+3.3V: 1.POWER (5 pins), 2.ETH (C30.2 P4.4 R47.1 R48.1), 9.RGB&TOUCH (13 pins)
AUGND: 0.CONNECTOR (32 pins), 1.POWER (23 pins), 2.ETH (C30.1 P4.1 Q1.1 Q2.1), 9.RGB&TOUCH (50 pins)
VCC5V: 0.CONNECTOR (J1.34 J1.35), 1.POWER (8 pins), 9.RGB&TOUCH (R49.1)
CSI_HSYNC: 0.CONNECTOR (J1.129), 9.RGB&TOUCH (R59.2 U4.17)
CSI_VSYNC: 0.CONNECTOR (J1.130), 9.RGB&TOUCH (R57.2 U4.18)
LCD_DATA0: 0.CONNECTOR (J1.7), 9.RGB&TOUCH (P5.45)
LCD_DATA1: 0.CONNECTOR (J1.8), 9.RGB&TOUCH (P5.44)
LCD_DATA2: 0.CONNECTOR (J1.9), 9.RGB&TOUCH (P5.43)
LCD_DATA3: 0.CONNECTOR (J1.10), 9.RGB&TOUCH (P5.42)
LCD_DATA4: 0.CONNECTOR (J1.11), 9.RGB&TOUCH (P5.41)
LCD_DATA5: 0.CONNECTOR (J1.12), 9.RGB&TOUCH (P5.40)
LCD_DATA6: 0.CONNECTOR (J1.13), 9.RGB&TOUCH (P5.39)
LCD_DATA7: 0.CONNECTOR (J1.14), 9.RGB&TOUCH (P5.38)
LCD_DATA8: 0.CONNECTOR (J1.15), 9.RGB&TOUCH (P5.36)
LCD_DATA9: 0.CONNECTOR (J1.16), 9.RGB&TOUCH (P5.35)
LCD_DATA10: 0.CONNECTOR (J1.17), 9.RGB&TOUCH (P5.34)
LCD_DATA11: 0.CONNECTOR (J1.18), 9.RGB&TOUCH (P5.33)
LCD_DATA12: 0.CONNECTOR (J1.19), 9.RGB&TOUCH (P5.32)
LCD_DATA13: 0.CONNECTOR (J1.20), 9.RGB&TOUCH (P5.31)
LCD_DATA14: 0.CONNECTOR (J1.21), 9.RGB&TOUCH (P5.30)
LCD_DATA15: 0.CONNECTOR (J1.22), 9.RGB&TOUCH (P5.29)
LCD_DATA16: 0.CONNECTOR (J1.23), 9.RGB&TOUCH (P5.27)
LCD_DATA17: 0.CONNECTOR (J1.24), 9.RGB&TOUCH (P5.26)
LCD_DATA18: 0.CONNECTOR (J1.25), 9.RGB&TOUCH (P5.25)
LCD_DATA19: 0.CONNECTOR (J1.26), 9.RGB&TOUCH (P5.24)
LCD_DATA20: 0.CONNECTOR (J1.27), 9.RGB&TOUCH (P5.23)
LCD_DATA21: 0.CONNECTOR (J1.28), 9.RGB&TOUCH (P5.22)
LCD_DATA22: 0.CONNECTOR (J1.29), 9.RGB&TOUCH (P5.21)
LCD_DATA23: 0.CONNECTOR (J1.30), 9.RGB&TOUCH (P5.20)
LCD_DE: 0.CONNECTOR (J1.3), 9.RGB&TOUCH (P5.50)
LCD_HSYNC: 0.CONNECTOR (J1.2), 9.RGB&TOUCH (P5.47)
LCD_PCLK: 0.CONNECTOR (J1.4), 9.RGB&TOUCH (P5.49)
LCD_VSYNC: 0.CONNECTOR (J1.1), 9.RGB&TOUCH (P5.48)
SAI2_BCLK: 0.CONNECTOR (J1.94), 9.RGB&TOUCH (R51.1)
SAI2_SYNC: 0.CONNECTOR (J1.96), 9.RGB&TOUCH (R52.1)